# Altium schematic sheet LED-PCB_Connector.SchDoc
size A; SheetNumber: 12; SheetTotal: 12
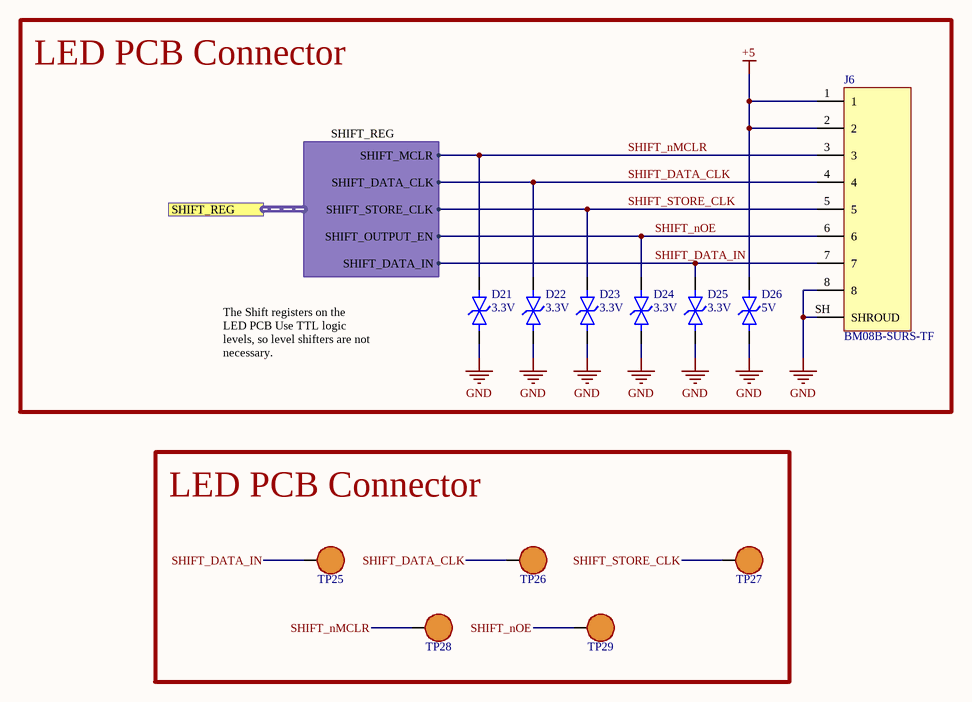
[diagram p0: LED-PCB_Connector.SchDoc]

## Parts
D21  VRS: 3.3V  [0402-TVS]  (hidden comment: DESD3V3E1BL-7B)
D22  VRS: 3.3V  [0402-TVS]  (hidden comment: DESD3V3E1BL-7B)
D23  VRS: 3.3V  [0402-TVS]  (hidden comment: DESD3V3E1BL-7B)
D24  VRS: 3.3V  [0402-TVS]  (hidden comment: DESD3V3E1BL-7B)
D25  VRS: 3.3V  [0402-TVS]  (hidden comment: DESD3V3E1BL-7B)
D26  VRS: 5V  [0402-TVS]  (hidden comment: DESD5V0U1BL-7B)
J6  BM08B-SURS-TF  [JST_BM08B-SURS-TF(LF)(SN)]
TP25  RCWCTE  [RCWCTE]  (value not drawn)
TP26  RCWCTE  [RCWCTE]  (value not drawn)
TP27  RCWCTE  [RCWCTE]  (value not drawn)
TP28  RCWCTE  [RCWCTE]  (value not drawn)
TP29  RCWCTE  [RCWCTE]  (value not drawn)

## Blocks framed on the sheet
LED PCB Connector: D21-D26 J6
LED PCB Connector: TP25-TP29

## Ports
SHIFT_REG (harness SHIFT_REG, see Brain-PCB_MASTER[4C], MCU[1B])

## Harnesses
SHIFT_REG: SHIFT_MCLR, SHIFT_STORE_CLK, SHIFT_DATA_IN, SHIFT_DATA_CLK, SHIFT_OUTPUT_EN

## Nets
+5: D26.1 J6.1 J6.2
GND: D21.2 D22.2 D23.2 D24.2 D25.2 D26.2 J6.8 J6.SH(SHROUD)
SHIFT_DATA_CLK: D22.1 J6.4 TP26.1 ; port SHIFT_REG.SHIFT_DATA_CLK
SHIFT_DATA_IN: D25.1 J6.7 TP25.1 ; port SHIFT_REG.SHIFT_DATA_IN
SHIFT_nMCLR: D21.1 J6.3 TP28.1 ; port SHIFT_REG.SHIFT_MCLR
SHIFT_nOE: D24.1 J6.6 TP29.1 ; port SHIFT_REG.SHIFT_OUTPUT_EN
SHIFT_STORE_CLK: D23.1 J6.5 TP27.1 ; port SHIFT_REG.SHIFT_STORE_CLK

## Notes on the sheet
- The Shift registers on the LED PCB Use TTL logic levels, so level shifters are not necessary.

## Library data of the parts
D21-D25 = TVS Diode 3.3V Bi: TVS DIODE 3.3VWM 7VC DFN1006-2; MFR: Diodes Incorporated; Type: SMD; VBR: 3.8V; VC: 7V; MFR PN: DESD3V3E1BL-7B
D26 = TVS Diode 5V Bi: TVS DIODE 5VWM 7.2VC DFN1006-2; MFR: Diodes Incorporated; Type: SMD; VBR: 5.5V; VC: 7.2V; MFR PN: DESD5V0U1BL-7B
J6 = CONN 8POS 0.8MM PITCH: CONN HEADER SMD 8POS 0.8MM; MFR: JST; MFR PN: BM08B-SURS-TF; Type: SMD
TP25-TP29 = TEST POINT: Test Point, Surface Mount; MFR: KOA Speer Electronics, Inc.; MFR PN: RCWCTE; Type: SMD